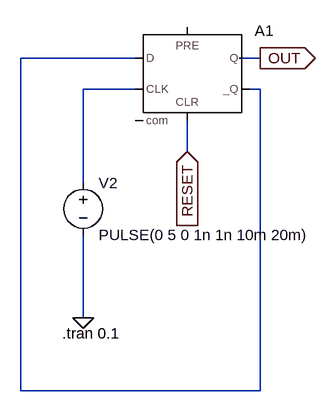
[diagram p0: schematic D HALFMOTHERF.asc]
D HALFMOTHERF.asc, the LTspice schematic file:
Version 4
SHEET 1 880 680
WIRE 80 -192 -96 -192
WIRE 272 -192 240 -192
WIRE 80 -144 0 -144
WIRE 272 -144 256 -144
WIRE 160 -48 160 -96
WIRE 0 0 0 -144
WIRE 0 208 0 80
WIRE -96 320 -96 -192
WIRE 272 320 272 -144
WIRE 272 320 -96 320
FLAG 0 208 0
FLAG 272 -192 OUT
IOPIN 272 -192 Out
FLAG 160 -48 RESET
IOPIN 160 -48 In
SYMBOL voltage 0 -16 R0
WINDOW 123 0 0 Left 0
WINDOW 39 0 0 Left 0
SYMATTR InstName V2
SYMATTR Value PULSE(0 5 0 1n 1n 10m 20m)
SYMBOL Digital\\dflop 160 -240 R0
SYMATTR InstName A1
TEXT -32 232 Left 2 !.tran 0.1

The netlist it stands for:
* D HALFMOTHERF.asc
V2 N002 0 PULSE(0 5 0 1n 1n 10m 20m)
A1 N001 0 N002 0 RESET N001 OUT 0 DFLOP
.tran 0.1
.backanno
.end